# Altium schematic sheet Condor2_tp_REV_C.SchDoc
size A4; DrawnBy: Philip Rowse
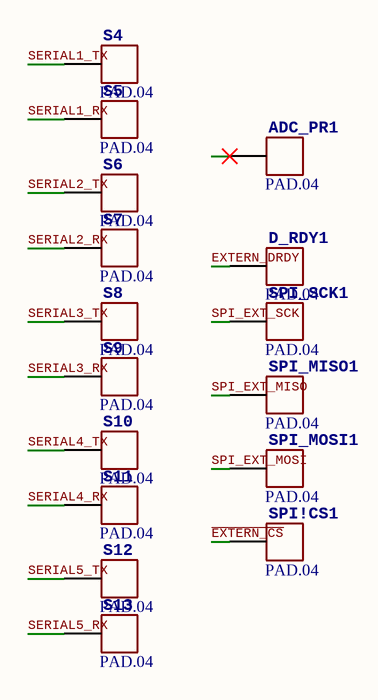
[diagram p0: Condor2_tp_REV_C.SchDoc]

## Parts
ADC_PR1  PAD.04  [PAD.04X.04]
D_RDY1  PAD.04  [PAD.04X.04]
S4  PAD.04  [PAD.04X.04]
S5  PAD.04  [PAD.04X.04]
S6  PAD.04  [PAD.04X.04]
S7  PAD.04  [PAD.04X.04]
S8  PAD.04  [PAD.04X.04]
S9  PAD.04  [PAD.04X.04]
S10  PAD.04  [PAD.04X.04]
S11  PAD.04  [PAD.04X.04]
S12  PAD.04  [PAD.04X.04]
S13  PAD.04  [PAD.04X.04]
SPI!CS1  PAD.04  [PAD.04X.04]
SPI_MISO1  PAD.04  [PAD.04X.04]
SPI_MOSI1  PAD.04  [PAD.04X.04]
SPI_SCK1  PAD.04  [PAD.04X.04]

## Nets
~{EXTERN_CS}: SPI!CS1.P$1
EXTERN_DRDY: D_RDY1.P$1
SERIAL1_RX: S5.P$1
SERIAL1_TX: S4.P$1
SERIAL2_RX: S7.P$1
SERIAL2_TX: S6.P$1
SERIAL3_RX: S9.P$1
SERIAL3_TX: S8.P$1
SERIAL4_RX: S11.P$1
SERIAL4_TX: S10.P$1
SERIAL5_RX: S13.P$1
SERIAL5_TX: S12.P$1
SPI_EXT_MISO: SPI_MISO1.P$1
SPI_EXT_MOSI: SPI_MOSI1.P$1
SPI_EXT_SCK: SPI_SCK1.P$1

Not connected (* = marked no-connect by the designer): ADC_PR1 P$1*

## Notes on the sheet
- Title:
- Date:
- Time:
- https://creativecommons.org/publicdomain/zero/1.0/
- Sheet:
- Approved:
- of:
- Drawn By:
- Checked By:
- ProfiCNC